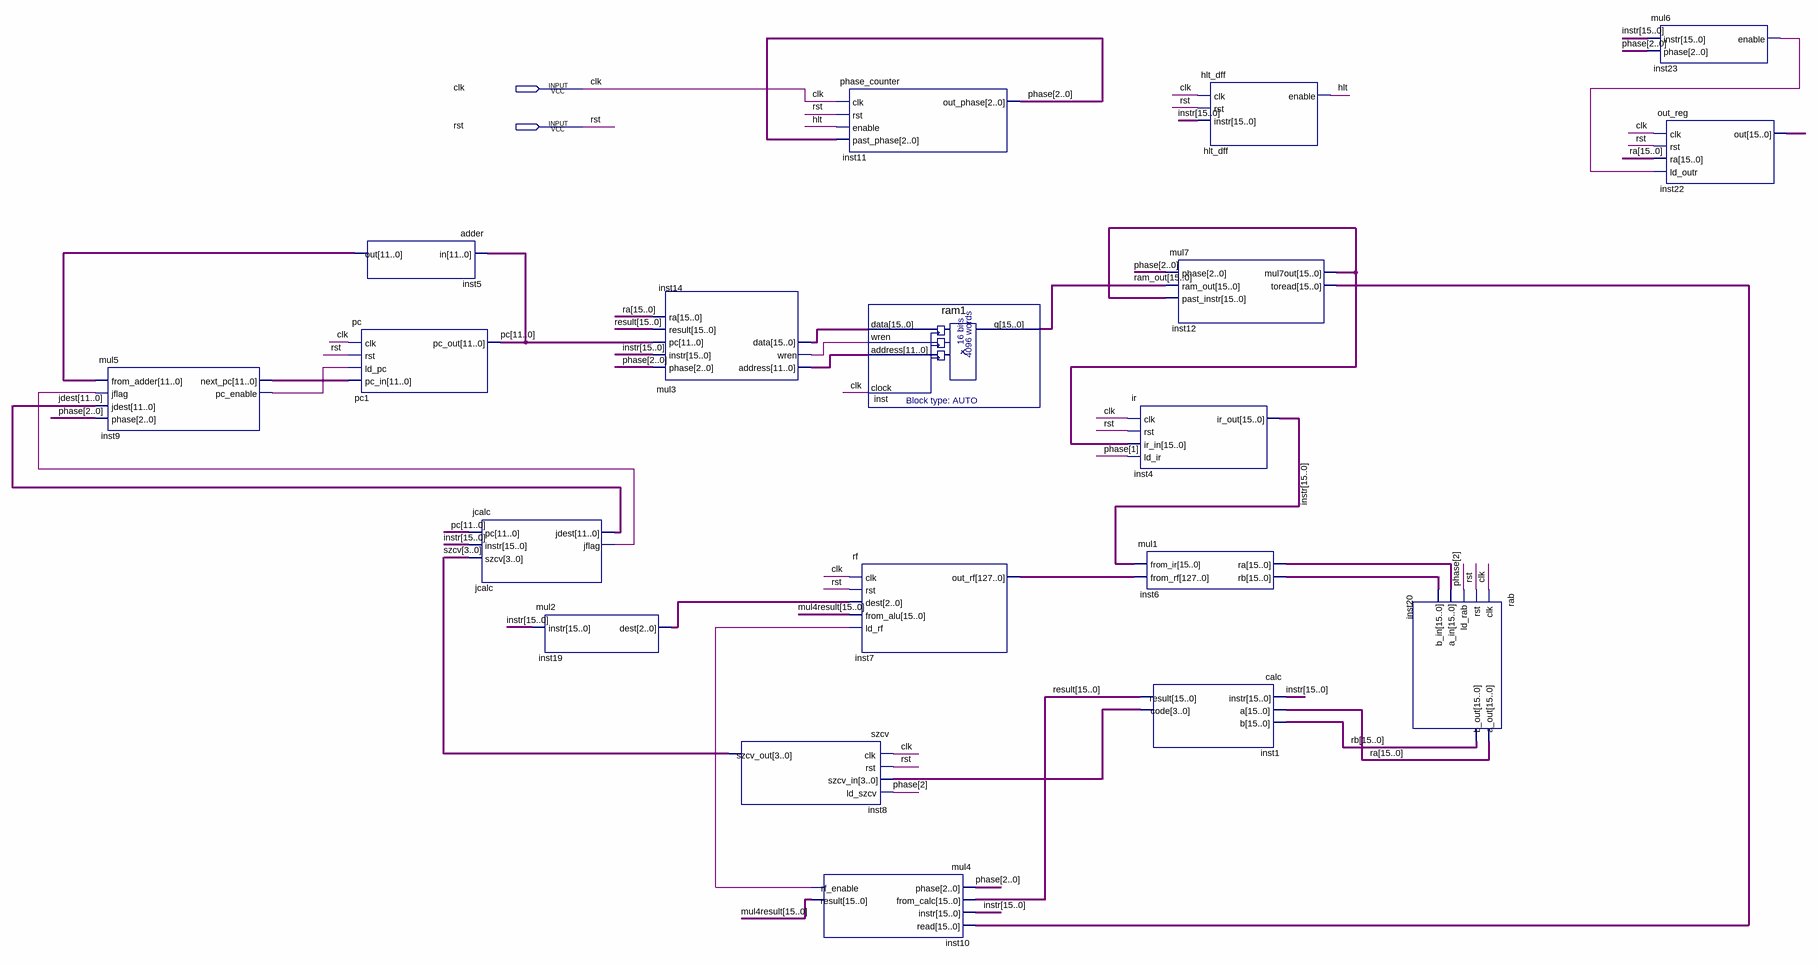
[diagram p0: schematic sheet]
// Quartus schematic SIMPLE.bdf as structural Verilog: 19 symbols, 2 pins
module SIMPLE (
  input  clk,
  input  rst
);

  wire hlt, inst9_pc_enable, inst10_rf_enable, inst14_wren, inst23_enable, jcalc_jflag;
  wire [2:0] inst19_dest, phase;
  wire [3:0] inst1_code, szcv;
  wire [11:0] inst5_out, inst9_next_pc, inst14_address, jdest, pc;
  wire [15:0] inst6_ra, inst6_rb, inst12_mul7out, inst12_toread, inst14_data, inst22_out, instr, mul4result,
       ra, ram_out, rb, result;
  wire [127:0] inst7_out_rf;

  mul5 inst9 (
    .from_adder(inst5_out), .jflag(jcalc_jflag), .jdest(jdest), .phase(phase), .next_pc(inst9_next_pc),
    .pc_enable(inst9_pc_enable));
  adder inst5 (.in(pc), .out(inst5_out));
  pc pc1 (.clk(clk), .rst(rst), .ld_pc(inst9_pc_enable), .pc_in(inst9_next_pc), .pc_out(pc));
  jcalc jcalc (.pc(pc), .instr(instr), .szcv(szcv), .jdest(jdest), .jflag(jcalc_jflag));
  mul2 inst19 (.instr(instr), .dest(inst19_dest));
  mul3 inst14 (
    .phase(phase), .instr(instr), .pc(pc), .result(result), .ra(ra), .address(inst14_address),
    .wren(inst14_wren), .data(inst14_data));
  szcv inst8 (.clk(clk), .rst(rst), .szcv_in(inst1_code), .ld_szcv(phase[2]), .szcv_out(szcv));
  mul4 inst10 (
    .phase(phase), .from_calc(result), .instr(instr), .read(inst12_toread), .rf_enable(inst10_rf_enable),
    .result(mul4result));
  phase_counter inst11 (.clk(clk), .rst(rst), .enable(hlt), .past_phase(phase), .out_phase(phase));
  rf inst7 (
    .clk(clk), .rst(rst), .dest(inst19_dest), .from_alu(mul4result), .ld_rf(inst10_rf_enable),
    .out_rf(inst7_out_rf));
  ram1 inst (.data(inst14_data), .wren(inst14_wren), .address(inst14_address), .clock(clk), .q(ram_out));
  mul7 inst12 (
    .phase(phase), .ram_out(ram_out), .past_instr(inst12_mul7out), .mul7out(inst12_mul7out),
    .toread(inst12_toread));
  ir inst4 (.clk(clk), .rst(rst), .ir_in(inst12_mul7out), .ld_ir(phase[1]), .ir_out(instr));
  mul1 inst6 (.from_ir(instr), .from_rf(inst7_out_rf), .ra(inst6_ra), .rb(inst6_rb));
  calc inst1 (.instr(instr), .a(ra), .b(rb), .result(result), .code(inst1_code));
  hlt_dff hlt_dff (.clk(clk), .rst(rst), .instr(instr), .enable(hlt));
  rab inst20 (.clk(clk), .rst(rst), .ld_rab(phase[2]), .a_in(inst6_ra), .b_in(inst6_rb), .a_out(ra), .b_out(rb));
  mul6 inst23 (.instr(instr), .phase(phase), .enable(inst23_enable));
  out_reg inst22 (.clk(clk), .rst(rst), .ra(ra), .ld_outr(inst23_enable), .out(inst22_out));
endmodule
